# EAGLE schematic untitled (EAGLE 7.6.0)
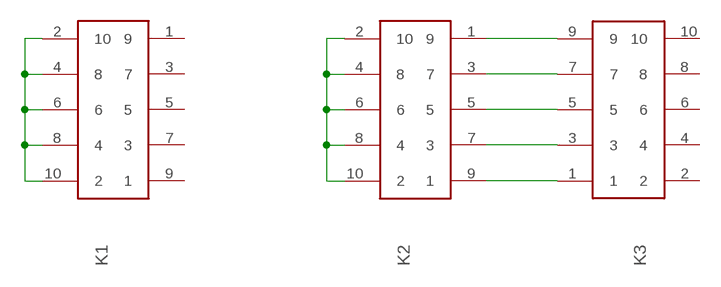
[diagram p0: schematic, sheet 1]

## Parts
K1  61201021721  [61201021721]
K2  61201021721  [61201021721]
K3  612X1020621  [612X1020621]

## Nets
N$1: K2.9 K3.1
N$2: K2.7 K3.3
N$3: K2.5 K3.5
N$4: K2.3 K3.7
N$5: K2.1 K3.9
N$6: K2.2 K2.4 K2.6 K2.8 K2.10
N$7: K1.2 K1.4 K1.6 K1.8 K1.10
Unconnected: K1.1 K1.3 K1.5 K1.7 K1.9 K3.2 K3.4 K3.6 K3.8 K3.10

## Library data of the parts
K1 K2 = Wire_to_Board_Connectors_rev15d:61201021721: WR-BHD 2.54mm Male Angled Box Header, 10 Pins=>Code : Con_WTB_BHD_2.54_Male_THT_WS_61201021721 <http://katalog.we-online.de/media/thumbs2/eican/thb_Con_WTB_BHD_2.54_Male_THT_WS_6120xx21721_pf2.jpg> Details see: http://katalog.we-online.de/en/em/612_0xx_217_21 Created 2014-06-05, Karrer Zheng 2014 (C) Würth Elektronik
K3 = Wire_to_Board_Connectors_rev15d:612X1020621: WR-BHD 2.54mm Male SMT Box Header High Temperature, 10 Pins=>Code : Con_WTB_BHD_2.54_Male_SMT_612X1020621 <http://katalog.we-online.de/media/thumbs2/eican/thb_Con_WTB_BHD_2.54_Male_SMT_6120xx20621_pf2.jpg> Details see: http://katalog.we-online.de/en/em/612_0xx_206_21 Created 2014-06-05, Karrer Zheng 2014 (C) Würth Elektronik